# EAGLE design display (EAGLE 9.1.1)
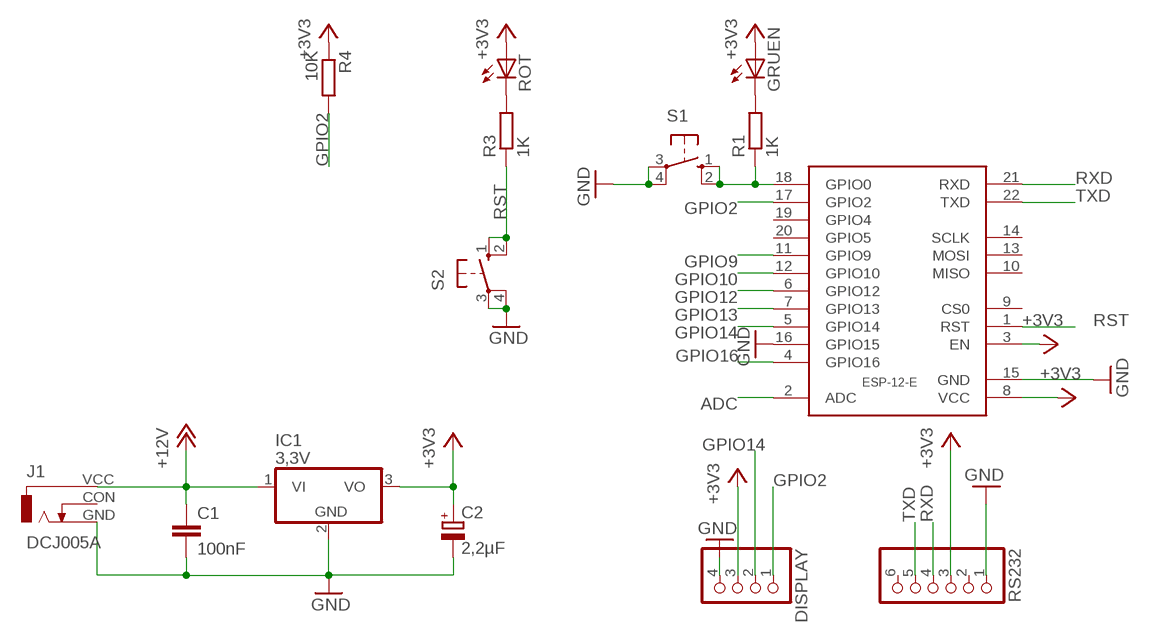
[diagram p0: schematic, sheet 1]

## Parts
C1  100nF  C-EU050-030X075  [C050-030X075]
C2  2,2µF  CPOL-EUE2.5-6  [E2,5-6]
DISPLAY  PINHD-1X4  [1X04]
GRUEN  LED5MM  [LED5MM]
IC1  3,3V  7805TV  [TO220V]
J1  DCJ005A  [DC005A]
R1  1K  R-EU_0207/10  [0207/10]
R3  1K  R-EU_0207/10  [0207/10]
R4  10K  R-EU_0207/10  [0207/10]
ROT  LED5MM  [LED5MM]
RS232  PINHD-1X6  [1X06]
S1  10-XX  [B3F-10XX]
S2  10-XX  [B3F-10XX]
U$1  ESP-12-E  [ESP-12-E]

## Nets
+3V3: C2.+ DISPLAY.3 GRUEN.A IC1.3(VO) R4.1 ROT.A RS232.3 U$1.3(EN) U$1.8(VCC)
+12V: C1.1 IC1.1(VI) J1.VCC
ADC: U$1.2(ADC)
GND: C1.2 C2.- DISPLAY.4 IC1.2(GND) J1.GND RS232.1 S1.3(P) S1.4(P1) S2.3(P) S2.4(P1) U$1.15(GND) U$1.16(GPIO15)
GPIO2: DISPLAY.1 R4.2 U$1.17(GPIO2)
GPIO9: U$1.11(GPIO9)
GPIO10: U$1.12(GPIO10)
GPIO12: U$1.6(GPIO12)
GPIO13: U$1.7(GPIO13)
GPIO14: DISPLAY.2 U$1.5(GPIO14)
GPIO16: U$1.4(GPIO16)
N$1: R1.1 S1.1(S) S1.2(S1) U$1.18(GPIO0)
N$3: GRUEN.K(C) R1.2
N$4: R3.2 ROT.K(C)
RST: R3.1 S2.1(S) S2.2(S1) U$1.1(RST)
RXD: RS232.4 U$1.21(RXD)
TXD: RS232.5 U$1.22(TXD)
Unconnected: J1.CON RS232.2 RS232.6 U$1.9(CS0) U$1.10(MISO) U$1.13(MOSI) U$1.14(SCLK) U$1.19(GPIO4) U$1.20(GPIO5)

## Library data of the parts
C1 = rcl:C-EU: CAPACITOR, European symbol
C2 = rcl:CPOL-EU: POLARIZED CAPACITOR, European symbol
DISPLAY = pinhead:PINHD-1X4: PIN HEADER
GRUEN ROT = !Häufige Bauteile:LED5MM
IC1 = linear:78*: Positive VOLTAGE REGULATOR Source: http://cache.national.com/ds/LM/LM78L05.pdf http://www.fairchildsemi.com/ds/LM/LM7805.pdf
J1 = !Häufige Bauteile:DCJ005A: DC POWER JACK Source: DCJ0202.pdf; OC_FARNELL: unknown; OC_NEWARK: unknown
R1 R3 R4 = rcl:R-EU_: RESISTOR, European symbol
RS232 = pinhead:PINHD-1X6: PIN HEADER
S1 S2 = switch-omron:10-XX: OMRON SWITCH; MPN: B3F-1000; OC_FARNELL: 176432; OC_NEWARK: 36M3542
U$1 = !Eigene Library SMD:ESP-12-E

## Board
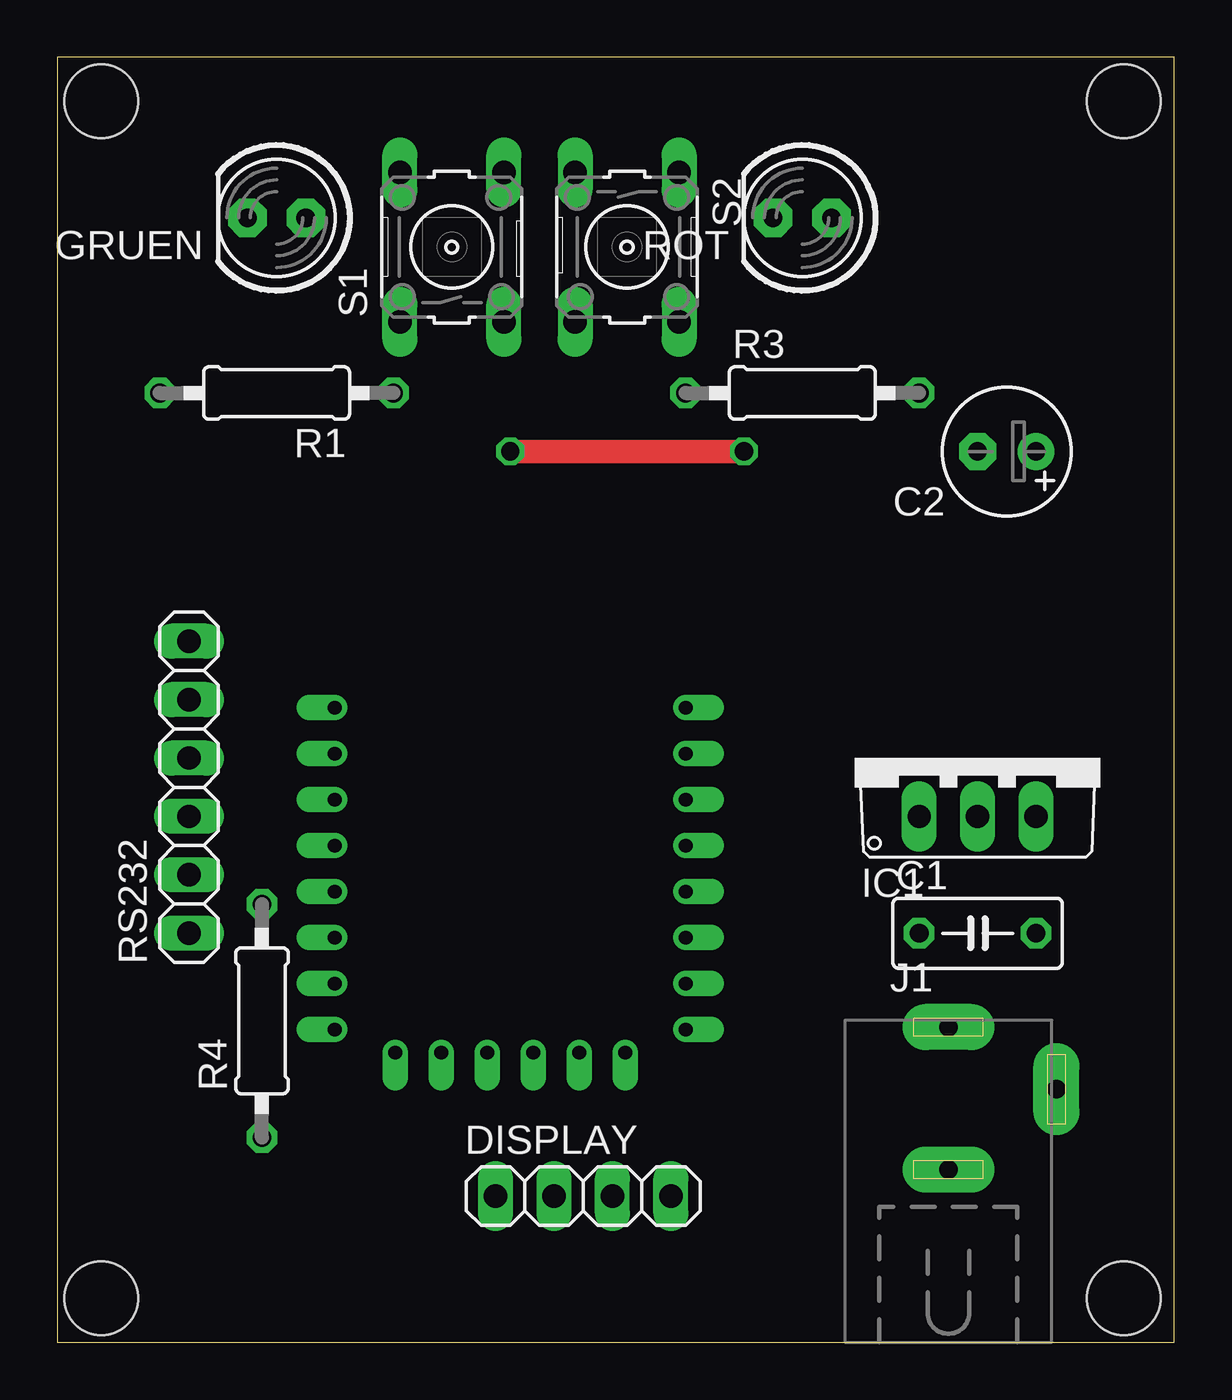
[diagram p1: board, top side]
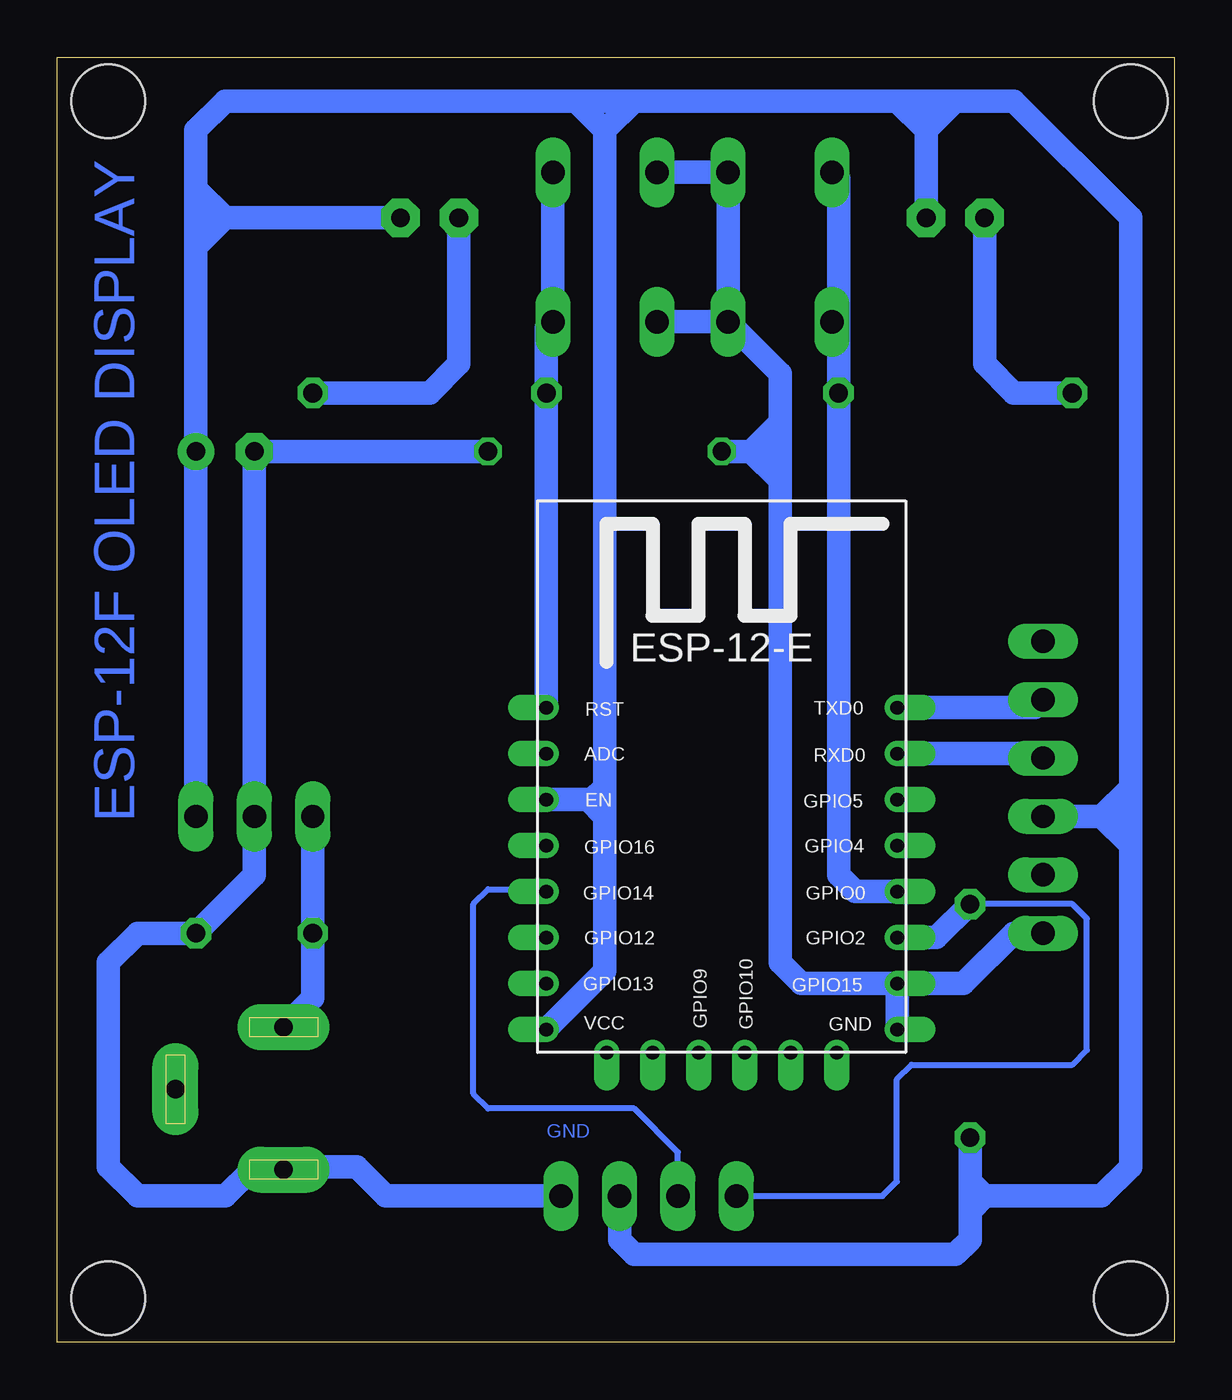
[diagram p2: board, bottom side, seen from below]

Size 48.57 x 55.87 mm. Coordinates in mm from the lower left corner, seen from the top.
Outline: 0,0 48.57,0 48.57,55.87 0,55.87 0,0
Copper layers (1*16): Top 0.035mm / dielectric 1.5mm / Bottom 0.035mm
Design rules "platinenbelichter": minimum track width 10mil, minimum drill 24mil, track to track 10mil, track to pad 10mil, pad to pad 10mil, via to via 10mil, smd to smd 10mil, copper to edge 40mil, drill to drill 8mil, minimum pad ring 10mil, minimum via ring 8mil, stop-mask expansion 10mil, vias tented up to drill 0mil, thermal gap 10mil
Holes 3.2 mm at 1.91,53.98 46.36,53.98 1.91,1.91 46.36,1.91

### Footprints (pad centres in the part's own frame; a part is rotated, then mirrored left to right if it is on the bottom)
C050-030X075 = drill 0.813 octagon: 1 -2.54,0; 2 2.54,0
E2,5-6 = drill 0.813 pad 1.6: + -1.27,0 | drill 0.813 pad 1.6 octagon: - 1.27,0
1X04 = drill 1.016 long: 1 -3.81,0; 2 -1.27,0; 3 1.27,0; 4 3.81,0
LED5MM = drill 0.813 pad 1.676 octagon: A -1.27,0; K 1.27,0
TO220V = drill 1.016 long: 1 -2.54,-2.54; 2 0,-2.54; 3 2.54,-2.54
DC005A = drill 0.8 pad 2 long: CON 4.7,4.65; GND 0,1.15; VCC 0,7.35
0207/10 = drill 0.813 octagon: 1 -5.08,0; 2 5.08,0
1X06 = drill 1.016 long: 1 -6.35,0; 2 -3.81,0; 3 -1.27,0; 4 1.27,0; 5 3.81,0; 6 6.35,0
B3F-10XX = drill 1.016 long: 1 -3.251,2.261; 2 3.251,2.261; 3 -3.251,-2.261; 4 3.251,-2.261
ESP-12-E = drill 0.6 offset: 1 -7.635,6; 2 -7.635,4; 3 -7.635,2; 4 -7.635,0; 5 -7.635,-2; 6 -7.635,-4; 7 -7.635,-6; 8 -7.635,-8; 9 -5,-9; 10 -3,-9; 11 -1,-9; 12 1,-9; 13 3,-9; 14 5,-9; 15 7.635,-8; 16 7.635,-6; 17 7.635,-4; 18 7.635,-2; 19 7.635,0; 20 7.635,2; 21 7.635,4; 22 7.635,6

### Placement (x,y rotation side)
C1  40.01,17.78 0 top
C2  41.28,38.73 180 top
DISPLAY  22.86,6.35 0 top
GRUEN  9.52,48.9 180 top
IC1  40.01,25.4 0 top
J1  38.73,6.35 0 top
R1  9.52,41.27 180 top
R3  32.39,41.27 0 top
R4  8.89,13.97 90 top
ROT  32.39,48.9 180 top
RS232  5.72,24.13 90 top
S1  17.14,47.62 90 top
S2  24.77,47.62 270 top
U$1  19.68,21.59 0 bottom

### Tracks (layer width: path | path; a pad name or v marks a point on that pad's centre or on a via)
+3V3
  Bottom 1.016: U$1.3 25.5,23.59 | 25.3,23.59 24.77,23.59 | 24.77,24.13 24.77,23.59 | 24.77,52.7 24.77,24.13 | 23.5,53.98 12.07,53.98 | 12.07,53.98 10.8,53.98 | 10.8,53.98 10.8,52.7 | 10.8,52.7 GRUEN.A | IC1.3 C2.+ 42.55,47.62 | 42.55,47.62 42.55,48.9 | 42.55,48.9 42.55,50.16 | 42.55,50.16 42.55,52.7 41.28,53.98 26.04,53.98 | ROT.A 41.28,48.9 | 41.28,48.9 42.55,48.9 | 10.8,53.98 9.52,53.98 | R4.1 8.89,6.99 | 8.89,6.99 8.25,6.35 | 10.8,52.7 12.07,53.98 | 10.8,52.7 9.52,53.98 | 24.77,52.7 23.5,53.98 | 24.77,52.7 26.04,53.98 | 41.28,48.9 42.55,50.16 | 41.28,48.9 42.55,47.62 | 9.52,53.98 6.99,53.98 1.91,48.9 1.91,24.13 | 8.25,6.35 3.17,6.35 1.91,7.62 1.91,21.59 | 1.91,21.59 1.91,22.86 | 1.91,22.86 1.91,24.13 | U$1.8 24.77,16.14 24.77,22.86 | 24.77,23.59 24.77,22.86 | 25.5,23.59 24.77,22.86 | 25.5,23.59 25.3,23.59 | 25.3,23.59 24.77,24.13 | RS232.3 3.17,22.86 | 3.17,22.86 1.91,22.86 | 1.91,24.13 3.17,22.86 | 3.17,22.86 1.91,21.59 | 23.5,53.98 26.04,53.98 | 8.89,6.99 8.89,5.71 | 8.25,6.35 8.89,5.71 | 8.89,5.71 8.89,4.45 9.52,3.81 23.5,3.81 24.13,4.45 DISPLAY.3
+12V
  Bottom 1.016: IC1.1 C1.1 37.47,14.97 J1.VCC
GND  (via drill 0.8)
  Top 1.016: v29.85,38.73 v19.68,38.73
  Bottom 1.016: S1.3 S1.4 S2.3 | S1.3 S2.4 | v29.85,38.73 C2.- IC1.2 40.01,20.32 C1.2 45.09,17.78 46.36,16.51 46.36,7.62 45.09,6.35 41.28,6.35 40.12,7.5 J1.GND 38.62,7.62 35.56,7.62 34.29,6.35 DISPLAY.4 | S1.3 17.14,42.11 17.14,40.01 | 17.14,40.01 17.14,38.73 | 17.14,38.73 17.14,37.47 | v19.68,38.73 18.41,38.73 | 18.41,38.73 17.14,38.73 | 17.14,40.01 18.41,38.73 | 18.41,38.73 17.14,37.47 | U$1.16 16.22,15.59 17.14,16.51 17.14,37.47 | U$1.15 U$1.16 | U$1.16 9.18,15.59 6.99,17.78 RS232.1
GPIO2
  Bottom 0.254: DISPLAY.1 12.7,6.35 12.07,6.99 12.07,11.43 11.43,12.06 4.45,12.06 3.81,12.7 3.81,18.41 4.45,19.05 R4.2
  Bottom 1.016: R4.2 10.35,17.59 U$1.17
GPIO14
  Bottom 0.254: DISPLAY.2 21.59,8.26 23.5,10.16 29.85,10.16 30.48,10.79 30.48,19.05 29.85,19.68 27.41,19.68 U$1.5
N$1
  Bottom 1.016: U$1.18 13.88,19.59 14.61,20.32 R1.1 14.61,44.09 | 14.61,44.09 S1.1 | S1.2 14.61,50.6 14.61,44.09
N$3
  Bottom 1.016: R1.2 6.99,41.27 8.25,42.55 GRUEN.K
N$4
  Bottom 1.016: ROT.K 31.11,42.55 32.39,41.27 R3.2
RST
  Bottom 1.016: S2.1 S2.2 27.3,44.09 R3.1 27.3,27.61 U$1.1
RXD
  Bottom 1.016: U$1.21 5.91,25.59 RS232.4
TXD
  Bottom 1.016: U$1.22 6.07,27.59 RS232.5

### Text on the board
Bottom: ESP-12F OLED DISPLAY | GND